# EAGLE schematic generator (EAGLE 7.2.0)
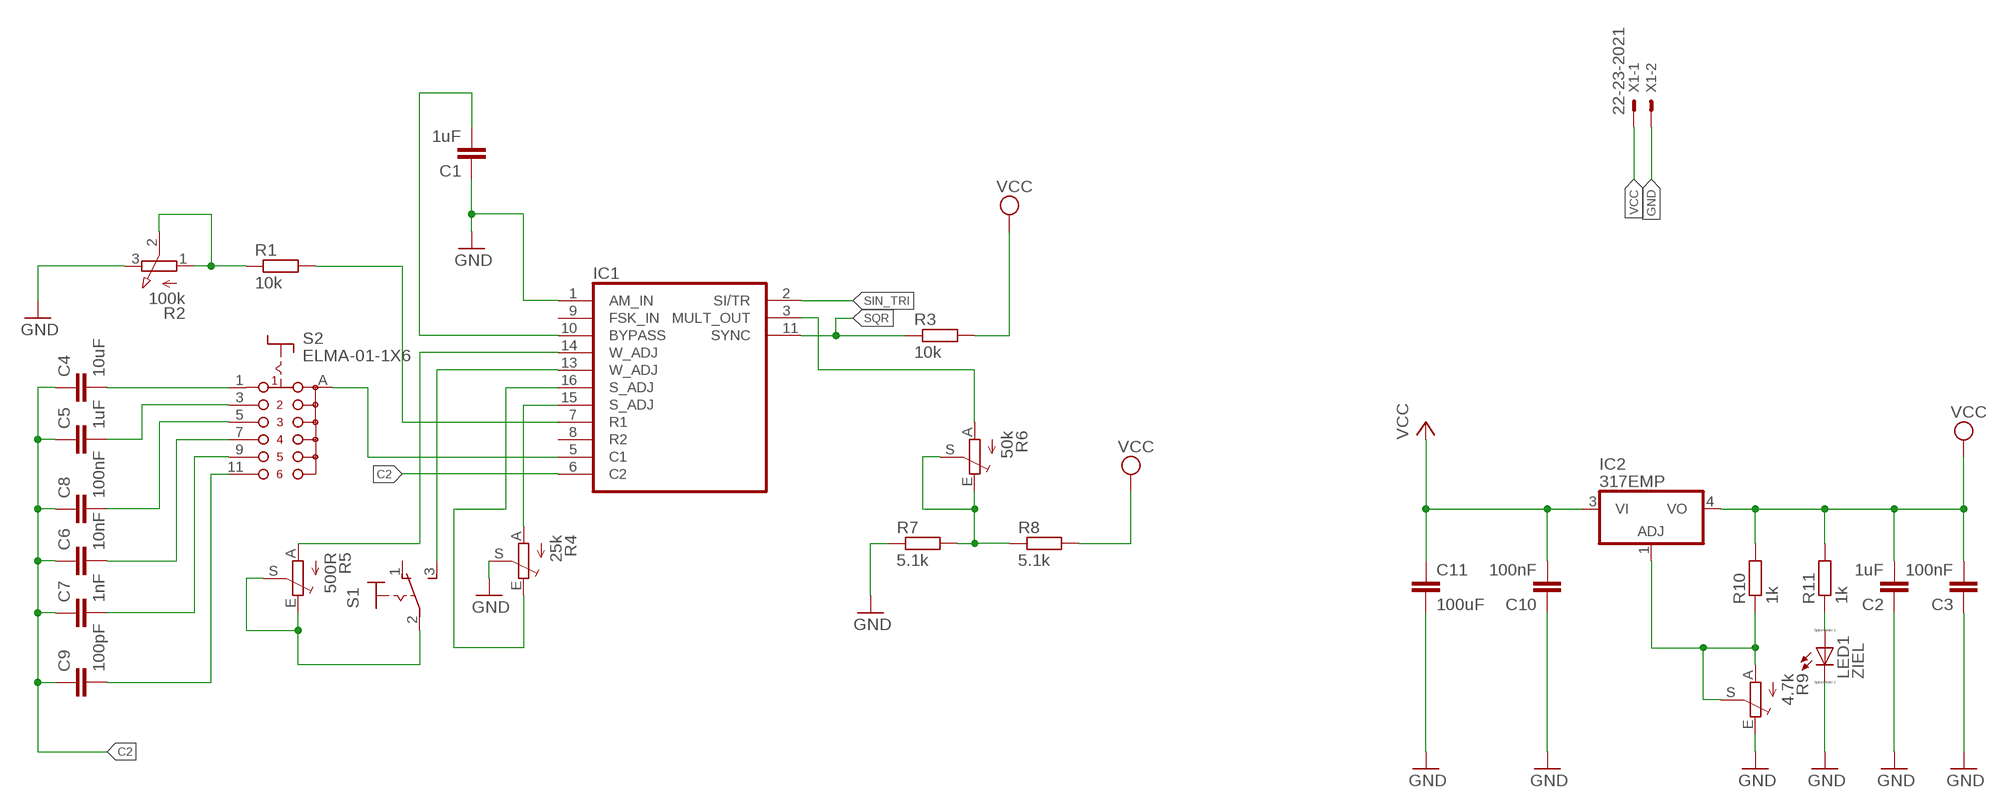
[diagram p0: schematic, sheet 1]

## Parts
C1  1uF  C-EUC0805  [C0805]
C2  1uF  C-EUC0805  [C0805]
C3  100nF  C-EUC0805  [C0805]
C4  10uF  C-EUC0805  [C0805]
C5  1uF  C-EUC0805  [C0805]
C6  10nF  C-EUC0805  [C0805]
C7  1nF  C-EUC0805  [C0805]
C8  100nF  C-EUC0805  [C0805]
C9  100pF  C-EUC0805  [C0805]
C10  100nF  C-EUC0805  [C0805]
C11  100uF  C-EUC0805  [C0805]
IC1  XR-2206  [DIL16]
IC2  317EMP  [SOT223]
LED1  ZIEL  LED_E  [LED_1206]
R1  10k  R-EU_R0805  [R0805]
R2  100k  3RP/1610N  [3RP/1610N]
R3  10k  R-EU_R0805  [R0805]
R4  25k  TRIM_EU-PTSPIN  [PT-SPIN]
R5  500R  TRIM_EU-PTSPIN  [PT-SPIN]
R6  50k  TRIM_EU-PTSPIN  [PT-SPIN]
R7  5.1k  R-EU_R0805  [R0805]
R8  5.1k  R-EU_R0805  [R0805]
R9  4.7k  TRIM_EU-PTSPIN  [PT-SPIN]
R10  1k  R-EU_R0805  [R0805]
R11  1k  R-EU_R0805  [R0805]
S1  320-916  [320-916]
S2  ELMA-01-1X6  [ELMA-01-1X6]
X1  22-23-2021  [22-23-2021]

## Nets
C2: C4.1 C5.1 C6.1 C7.1 C8.1 C9.1 IC1.6(C2)
GND: C1.1 C2.1 C3.1 C10.1 C11.2 IC1.1(AM_IN) LED1.C R2.3(E) R4.S R7.1 R9.E X1.2
N$1: C4.2 S2.1
N$2: IC1.5(C1) S2.A(S)
N$3: C5.2 S2.3
N$4: C8.2 S2.5
N$5: C6.2 S2.7
N$6: C7.2 S2.9
N$7: IC1.7(R1) R1.2
N$8: C9.2 S2.11
N$9: R1.1 R2.1(A) R2.2(S)
N$10: C1.2 IC1.10(BYPASS)
N$11: R6.E R6.S R7.2 R8.1
N$12: IC1.15(S_ADJ) R4.A
N$13: IC1.16(S_ADJ) R4.E
N$14: IC1.14(W_ADJ) R5.A
N$15: IC1.13(W_ADJ) S1.3(S)
N$16: R5.E R5.S S1.2(P)
N$17: IC1.3(MULT_OUT) R6.A
N$18: LED1.A R11.1
N$19: IC2.1(ADJ) R9.A R9.S R10.1
SIN_TRI: IC1.2(SI/TR)
SQR: IC1.11(SYNC) R3.1
VCC: C2.2 C3.2 C10.2 C11.1 IC2.3(VI) IC2.4(VO) R3.2 R8.2 R10.2 R11.2 X1.1
Unconnected: IC1.8(R2) IC1.9(FSK_IN) S1.1(O)

## Power pins joined to a net without a drawn wire
GND: IC1.12(GND)
VCC: IC1.4(VCC)

## Library data of the parts
C1-C11 = rcl:C-EU: CAPACITOR, European symbol
IC1 = exar:XR-2206: Monolithic FUNCTION GENERATOR; OC_FARNELL: unknown; OC_NEWARK: unknown
IC2 = linear:*317: Positive VOLTAGE REGULATOR
LED1 = eagle-ltspice:LED_E: LED Source: http://www.osram.convergy.de Source: www.luxeon.com Source: www.kingbright.com; SPICEMODEL: NONE; SPICEPREFIX: D; SPICETYPE: diode
R1 R3 R7 R8 R10 R11 = rcl:R-EU_: RESISTOR, European symbol
R2 = pot:3RP/1610N: 16mm Potentiometer one level Source: http://www.alphapotentiometers.net/html/16mm_pot_2.html
R4-R6 R9 = pot:TRIM_EU-: POTENTIOMETER
S1 = switch:320-916: TOGGLE SWITCH distributor RS Components
S2 = switch:ELMA-01-1X6: Rotary Switches Type 01 Source: http://www.elma.com/files/products/rotary_components/pdfs/rotary_switches_type_01_002.pdf
X1 = con-molex:22-23-2021: .100" (2.54mm) Center Header - 2 Pin; MF: MOLEX; MPN: 22-23-2021; OC_FARNELL: 1462926; OC_NEWARK: 25C3832